# Altium schematic sheet Slave_V1.SchDoc
size A2
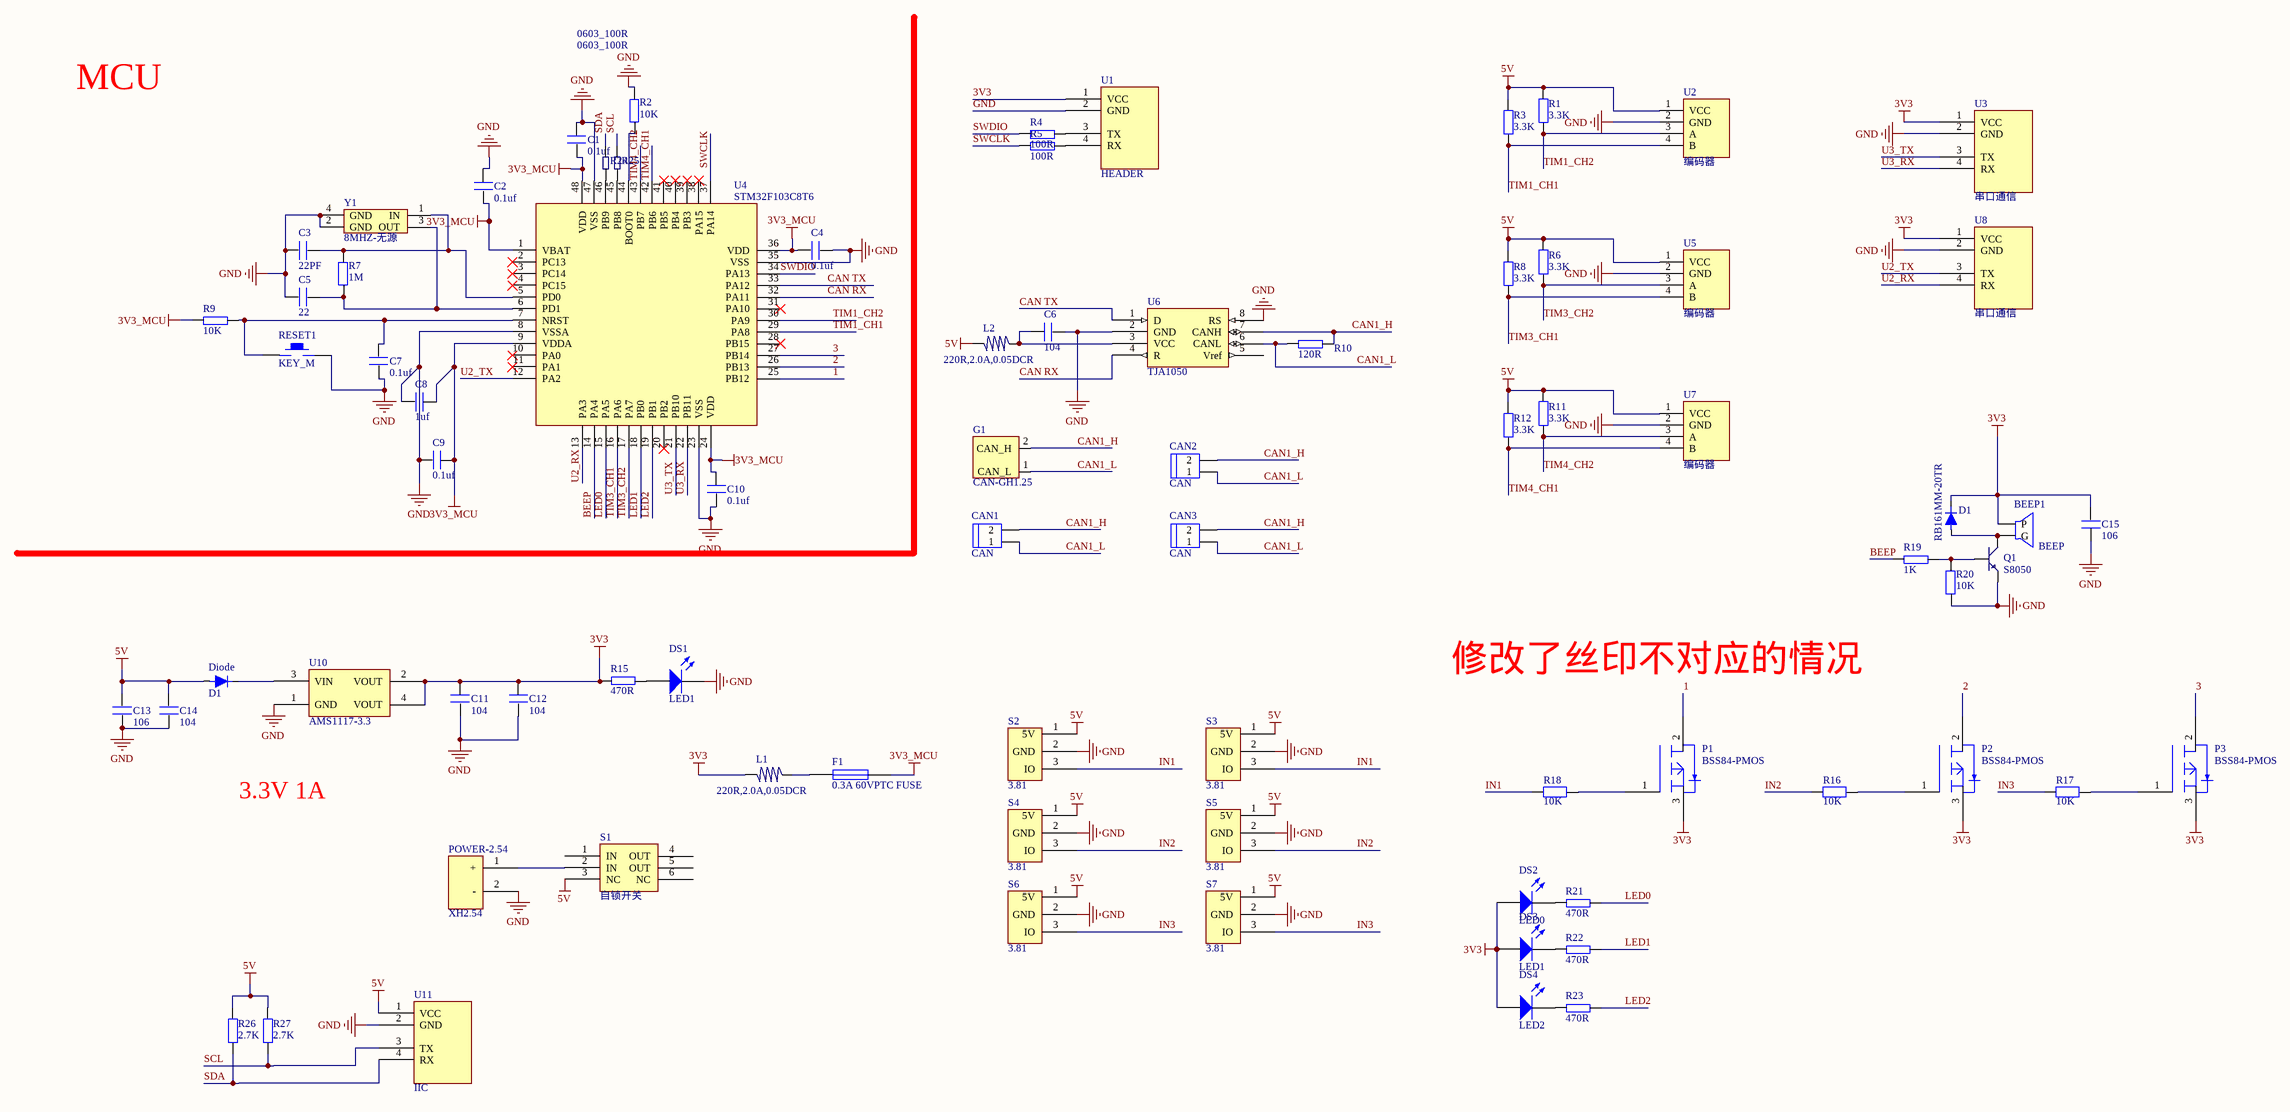
[diagram p0: Slave_V1.SchDoc]

## Parts
BEEP1  BEEP  [BELL-5]
C1  0.1uf  [0603P]
C2  0.1uf  [0603P]
C3  22PF  [0603P]
C4  0.1uf  [0603P]
C5  22  [0603P]
C6  104  [0603P]
C7  0.1uf  [0603P]
C8  1uf  [0603P]
C9  0.1uf  [0603P]
C10  0.1uf  [0603P]
C11  104  [0603P]
C12  104  [0603P]
C13  106  [0603P]
C14  104  [0603P]
C15  106  [0603C]
CAN1  CAN  [HEAD2L-0.8]
CAN2  CAN  [XH2.54-2]
CAN3  CAN  [XH2.54-2]
D1  RB161MM-20TR  [LC-SOD-123F]
Diode  D1  [LC-SOD-123F]
DS1  LED1  [0603_LED]
DS2  LED0  [0603_LED]
DS3  LED1  [0603_LED]
DS4  LED2  [0603_LED]
F1  0.3A 60VPTC FUSE  [LC-1812_R]
G1  CAN-GH1.25  [GH1.25_1*2_lishi]
L1  220R,2.0A,0.05DCR  [L_0603]
L2  220R,2.0A,0.05DCR  [0603P]
P1  BSS84-PMOS  [LC-SOT-23(SOT-23-3)]
P2  BSS84-PMOS  [LC-SOT-23(SOT-23-3)]
P3  BSS84-PMOS  [LC-SOT-23(SOT-23-3)]
POWER-2.54  XH2.54  [XH2.54-2]
Q1  S8050  [SOT-23R]
R1  3.3K  [0603P]
R2  10K  [0603P]
R3  3.3K  [0603P]
R4  100R  [0603P]
R5  100R  [0603P]
R6  3.3K  [0603P]
R7  1M  [0603P]
R8  3.3K  [0603P]
R9  10K  [0603P]
R10  120R  [0603P]
R11  3.3K  [0603P]
R12  3.3K  [0603P]
R15  470R  [0603P]
R16  10K  [0603P]
R17  10K  [0603P]
R18  10K  [0603P]
R19  1K  [0603R]
R20  10K  [0603R]
R21  470R  [0603R]
R22  470R  [0603R]
R23  470R  [0603R]
R24  0603_100R  [0603R]
R25  0603_100R  [0603R]
R26  2.7K  [0603R]
R27  2.7K  [0603R]
RESET1  KEY_M  [KEY_M]
S1  自锁开关  [自锁开关5.8*5.8]
S2  3.81  [KF2EDG-3.81-3P-弯针]
S3  3.81  [KF2EDG-3.81-3P-弯针]
S4  3.81  [KF2EDG-3.81-3P-弯针]
S5  3.81  [KF2EDG-3.81-3P-弯针]
S6  3.81  [KF2EDG-3.81-3P-弯针]
S7  3.81  [KF2EDG-3.81-3P-弯针]
U1  HEADER  [XH2.54-4]
U2  编码器  [XH2.54-4]
U3  串口通信  [XH2.54-4]
U4  STM32F103C8T6  [LQFP-48_7x7x05P]
U5  编码器  [XH2.54-4]
U6  TJA1050  [SOP8]
U7  编码器  [XH2.54-4]
U8  串口通信  [XH2.54-4]
U10  AMS1117-3.3  [SOT223]
U11  IIC  [XH2.54-4]
Y1  8MHZ-无源  [XTAL3225   无源]

## Nets
3V3: BEEP1.1(P) C11.2 C12.2 C15.1 D1.2 DS2.1(A) DS3.1(A) DS4.1(A) L1.2 P1.3(S) P2.3(S) P3.3(S) R15.2 U1.1(VCC) U3.1(VCC) U8.1(VCC) U10.2(VOUT) U10.4(VOUT)
3V3_MCU: C1.1 C2.1 C4.2 C8.1 C9.1 C10.2 F1.2 R9.1 U4.1(VBAT) U4.9(VDDA) U4.24(VDD) U4.36(VDD) U4.48(VDD)
5V: C13.2 C14.2 Diode.1 L2.2 R1.1 R3.1 R6.1 R8.1 R11.1 R12.1 R26.2 R27.2 S1.3(NC) S2.1(5V) S3.1(5V) S4.1(5V) S5.1(5V) S6.1(5V) S7.1(5V) U2.1(VCC) U5.1(VCC) U7.1(VCC) U11.1(VCC)
GND: C1.2 C2.2 C3.2 C4.1 C5.2 C6.2 C7.1 C8.2 C9.2 C10.1 C11.1 C12.1 C13.1 C14.1 C15.2 DS1.2(K) POWER-2.54.2(-) Q1.1(E) R2.1 R20.2 RESET1.2 S2.2(GND) S3.2(GND) S4.2(GND) S5.2(GND) S6.2(GND) S7.2(GND) U1.2(GND) U2.2(GND) U3.2(GND) U4.8(VSSA) U4.23(VSS) U4.35(VSS) U4.47(VSS) U5.2(GND) U6.2(GND) U6.8(RS) U7.2(GND) U8.2(GND) U10.1(GND) U11.2(GND) Y1.2(GND) Y1.4(GND)
1: P1.2(D) U4.25(PB12)
2: P2.2(D) U4.26(PB13)
3: P3.2(D) U4.27(PB14)
BEEP: R19.1 U4.14(PA4)
CAN1_H: CAN1.2 CAN2.2 CAN3.2 G1.2(CAN_H) R10.2 U6.7(CANH)
CAN1_L: CAN1.1 CAN2.1 CAN3.1 G1.1(CAN_L) R10.1 U6.6(CANL)
CAN RX: U4.32(PA11) U6.4(R)
CAN TX: U4.33(PA12) U6.1(D)
IN1: R18.1 S2.3(IO) S3.3(IO)
IN2: R16.1 S4.3(IO) S5.3(IO)
IN3: R17.1 S6.3(IO) S7.3(IO)
LED0: R21.2 U4.15(PA5)
LED1: R22.2 U4.18(PB0)
LED2: R23.2 U4.19(PB1)
SCL: R25.2 R27.1 U11.3(TX)
SDA: R24.2 R26.1 U11.4(RX)
SWCLK: R5.1 U4.37(PA14)
SWDIO: R4.1 U4.34(PA13)
TIM1_CH1: R3.2 U2.4(B) U4.29(PA8)
TIM1_CH2: R1.2 U2.3(A) U4.30(PA9)
TIM3_CH1: R8.2 U4.16(PA6) U5.4(B)
TIM3_CH2: R6.2 U4.17(PA7) U5.3(A)
TIM4_CH1: R12.2 U4.42(PB6) U7.4(B)
TIM4_CH2: R11.2 U4.43(PB7) U7.3(A)
U2_RX: U4.13(PA3) U8.4(RX)
U2_TX: U4.12(PA2) U8.3(TX)
U3_RX: U3.4(RX) U4.22(PB11)
U3_TX: U3.3(TX) U4.21(PB10)
NetBEEP1_2: BEEP1.2(G) D1.1 Q1.3(C)
NetC3_1: C3.1 R7.1 U4.5(PD0) Y1.1(IN)
NetC5_1: C5.1 R7.2 U4.6(PD1) Y1.3(OUT)
NetC6_1: C6.1 L2.1 U6.3(VCC)
NetC7_2: C7.2 R9.2 RESET1.1 U4.7(NRST)
NetDiode_2: Diode.2 U10.3(VIN)
NetDS1_1: DS1.1(A) R15.1
NetDS2_2: DS2.2(K) R21.1
NetDS3_2: DS3.2(K) R22.1
NetDS4_2: DS4.2(K) R23.1
NetF1_1: F1.1 L1.1
NetP1_1: P1.1(G) R18.2
NetP2_1: P2.1(G) R16.2
NetP3_1: P3.1(G) R17.2
NetPOWER-2.54_1: POWER-2.54.1(+) S1.2(IN)
NetQ1_2: Q1.2(B) R19.2 R20.1
NetR2_2: R2.2 U4.44(BOOT0)
NetR4_2: R4.2 U1.3(TX)
NetR5_2: R5.2 U1.4(RX)
NetR24_1: R24.1 U4.46(PB9)
NetR25_1: R25.1 U4.45(PB8)

Not connected (* = marked no-connect by the designer): S1 1(IN) 4(OUT) 5(OUT) 6(NC); U4 2(PC13)* 3(PC14)* 4(PC15)* 10(PA0)* 11(PA1)* 20(PB2)* 28(PB15)* 31(PA10)* 38(PA15)* 39(PB3)* 40(PB4)* 41(PB5)*; U6 5(Vref)

## Notes on the sheet
- MCU
- 修改了丝印不对应的情况
- 3.3V 1A

## Library data of the parts
C1-C15 = C
CAN1-CAN3 = HEAD2
D1 Diode = 肖特基
DS1-DS4 = LED2: Typical RED, GREEN, YELLOW, AMBER GaAs LED; Published: 8-Jun-2000; LatestRevisionDate: 17-Jul-2002; LatestRevisionNote: Re-released for DXP Platform.; PackageDocument: Feb-2002; PackageReference: 3.2X1.6X1.1; Publisher: Altium Limited
F1 = Fuse 1_2: Fuse; Published: 8-Jun-2000; LatestRevisionDate: 17-Jul-2002; LatestRevisionNote: Re-released for DXP Platform.; PackageReference: PIN-W2/E2.8; Publisher: Altium Limited; PackageDescription: Thru-Hole; 2 Leads
G1 = GH1.25-CAN
L1 L2 = L
POWER-2.54 = XH2.54-2
Q1 = NPN: 8050/BCW846/BCW847
R1 R3 R6 R8 R11 R12 R16-R18 R26 R27 = R-0805
R2 R4 R5 R7 R9 R10 R15 R19-R23 = R
R24 R25 = RES
S1 = Switch_5.8
S2-S7 = 槽型开关
U1 U3 U8 U11 = XH2.54插座-4P
U2 U5 U7 = 编码器4P
U6 = SN65HVD230D
U10 = AMS1117
Y1 = XTAL-3225